# EAGLE design Blinky555 (EAGLE 9.0.0)
LED Blinky using NE555
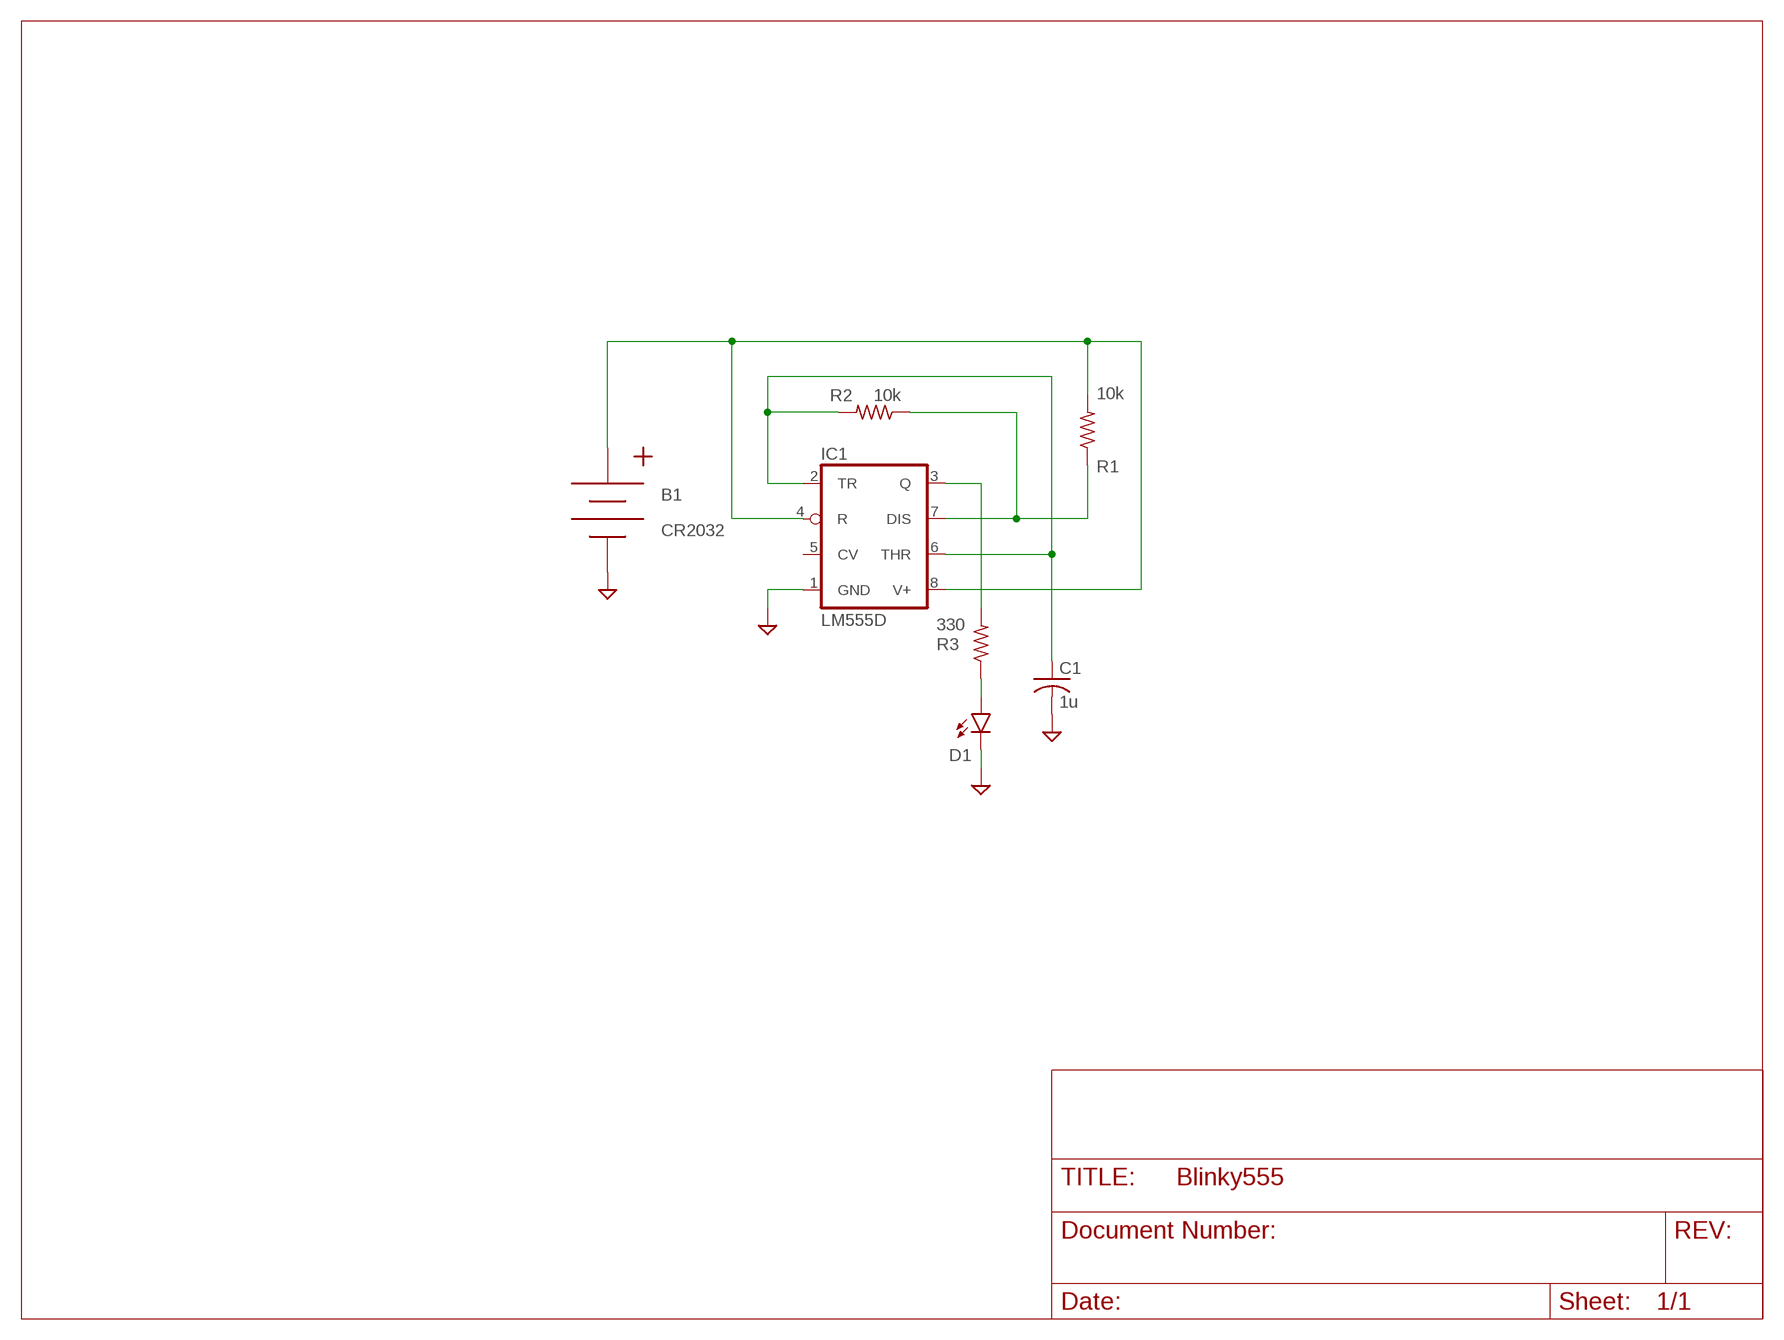
[diagram p0: schematic, sheet 1]

## Parts
B1  CR2032  HOLDER_CR2032  [BATTCON_20MM_4LEGS]
C1  1u  CAP  [C0805]
D1  LED  [LED_5MM]
IC1  LM555D  [SO08]
R1  10k  RES  [R0805]
R2  10k  RES  [R0805]
R3  330  RES  [R0805]

## Nets
+: B1.POSITIVE@1(+) B1.POSITIVE@2(+) B1.POSITIVE@3(+) B1.POSITIVE@4(+) IC1.4(R) IC1.8(V+) R1.2
GND: B1.NEGATIVE(-) C1.2 D1.K(C) IC1.1(GND)
N$1: IC1.7(DIS) R1.1 R2.1
N$2: C1.1 IC1.2(TR) IC1.6(THR) R2.2
N$4: D1.A R3.1
N$5: IC1.3(Q) R3.2
Unconnected: IC1.5(CV)

## Library data of the parts
B1 = League_555_Blinky:HOLDER_CR2032: CR2032 Coin Cell Holder
C1 = League_555_Blinky:CAP
D1 = League_555_Blinky:LED
IC1 = League_555_Blinky:*555: TIMER
R1-R3 = League_555_Blinky:RES: Resistor, 0805

## Board
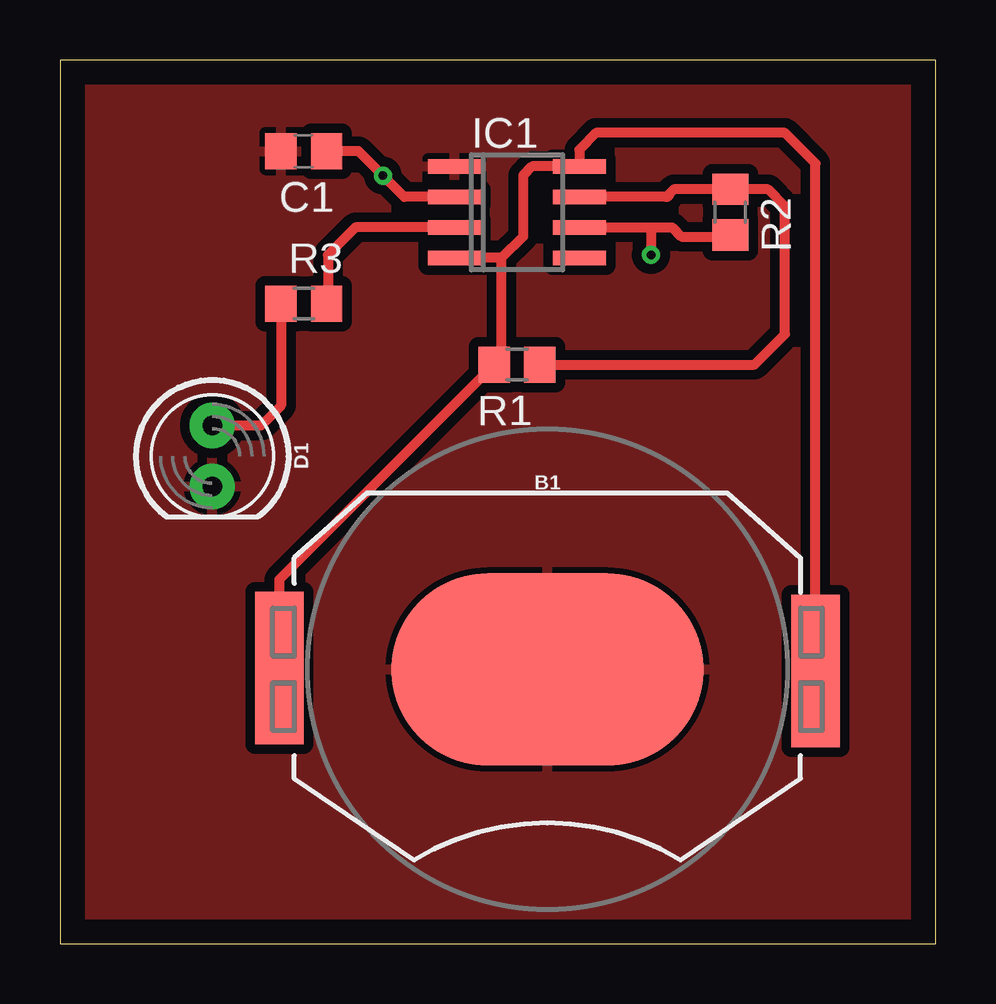
[diagram p1: board, top side]
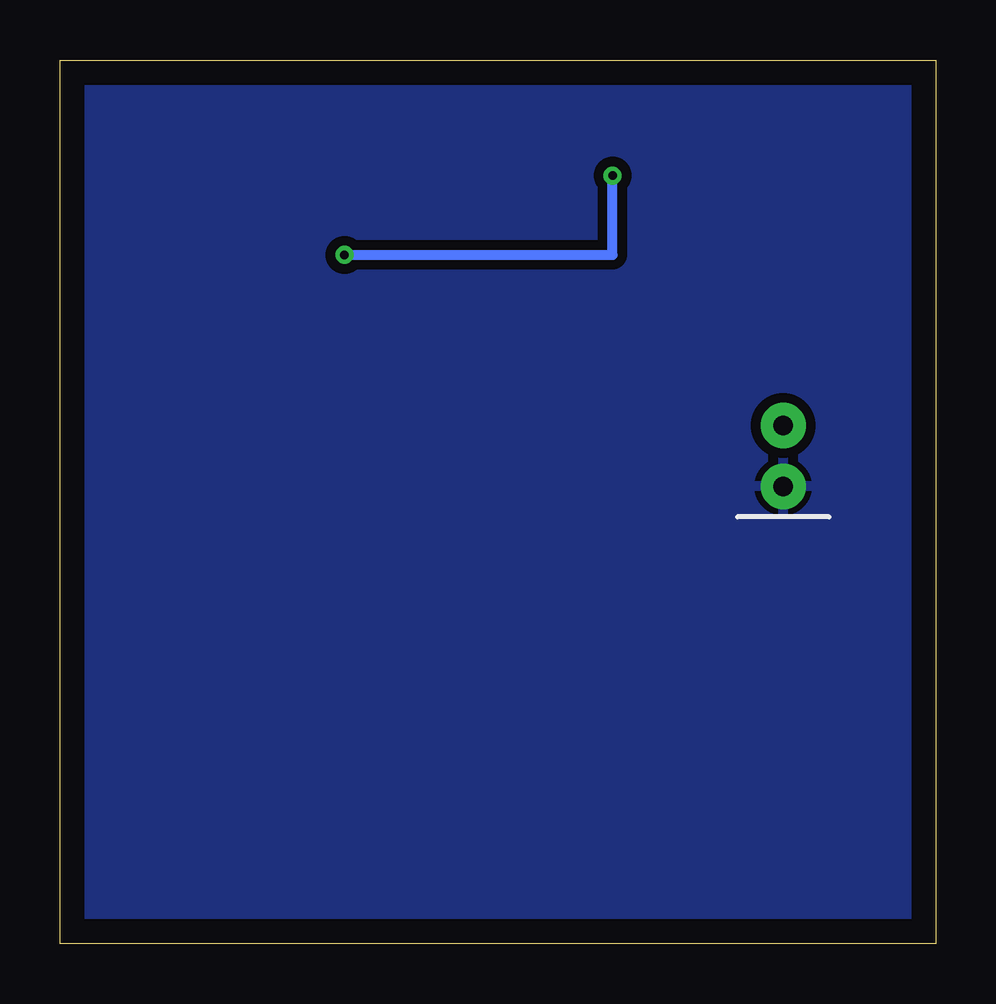
[diagram p2: board, bottom side, seen from below]

Size 36.5 x 36.82 mm. Coordinates in mm from the lower left corner, seen from the top.
Outline: 0,0 36.5,0 36.5,36.82 0,36.82 0,0
Copper layers (1*16): Top 0.035mm / dielectric 1.5mm / Bottom 0.035mm
Design rules "default": minimum track width 6mil, minimum drill 0.35mm, track to track 6mil, track to pad 6mil, pad to pad 6mil, via to via 6mil, smd to smd 6mil, copper to edge 40mil, drill to drill 6mil, minimum pad ring 10mil, minimum via ring 8mil, stop-mask expansion 4mil, vias tented up to drill 0mil, thermal gap 10mil

### Footprints (pad centres in the part's own frame; a part is rotated, then mirrored left to right if it is on the bottom)
BATTCON_20MM_4LEGS = smd 13 x 8: NEGATIVE 0,0 | smd 2.032 x 3.175: POSITIVE@1 -11.176,1.651; POSITIVE@2 -11.176,-1.524; POSITIVE@3 11.176,1.524; POSITIVE@4 11.176,-1.651
C0805 = smd 1.3 x 1.5: 1 -0.95,0; 2 0.95,0
LED_5MM = drill 0.813 pad 1.88: A -1.27,0; K 1.27,0
SO08 = smd 0.6 x 2.2: 1 -1.905,-2.6; 2 -0.635,-2.6; 3 0.635,-2.6; 4 1.905,-2.6; 5 1.905,2.6; 6 0.635,2.6; 7 -0.635,2.6; 8 -1.905,2.6
R0805 = smd 1.3 x 1.5: 1 -0.95,0; 2 0.95,0

### Placement (x,y rotation side)
B1  20.32,11.43 0 top
C1  10.16,33.02 180 top
D1  6.35,20.32 270 top
IC1  19.05,30.48 270 top
R1  19.05,24.13 180 top
R2  27.94,30.48 270 top
R3  10.16,26.67 0 top

### Tracks (layer width: path | path; a pad name or v marks a point on that pad's centre or on a via)
+
  Top 0.406: 18.41,28.57 IC1.4 | 18.41,28.57 19.3,29.46 19.3,32 19.68,32.38 IC1.8 21.65,33.08 22.35,33.78 30.23,33.78 31.5,32.51 B1.POSITIVE@3 B1.POSITIVE@4 | 18.41,28.57 18.41,24.45 R1.2 9.14,15.17 B1.POSITIVE@1 B1.POSITIVE@2
GND
  pour Top (isolate 0.406): 0,0.25 0,36.83 36.32,36.83 36.32,0 0,0
  pour Bottom (isolate 0.406): 0,0 36.83,0 36.83,36.83 0,36.83
N$1
  Top 0.406: IC1.7 25.27,31.11 arc90 25.4,31.24 25.59,31.43 R2.1 29.53,31.43 30.23,30.73 30.23,25.4 28.96,24.13 R1.1
N$2  (via drill 0.35)
  Top 0.406: C1.1 12.45,33.02 v13.46,32 14.35,31.11 IC1.2 | R2.2 27.87,29.46 25.91,29.46 25.53,29.84 IC1.6 24.64,29.84 v24.64,28.7
  Bottom 0.406: v24.64,28.7 13.46,28.7 v13.46,32
N$4
  Top 0.406: R3.1 9.21,22.42 8.38,21.59 D1.A
N$5
  Top 0.406: IC1.3 12.32,29.84 11.18,28.7 11.18,26.74 R3.2